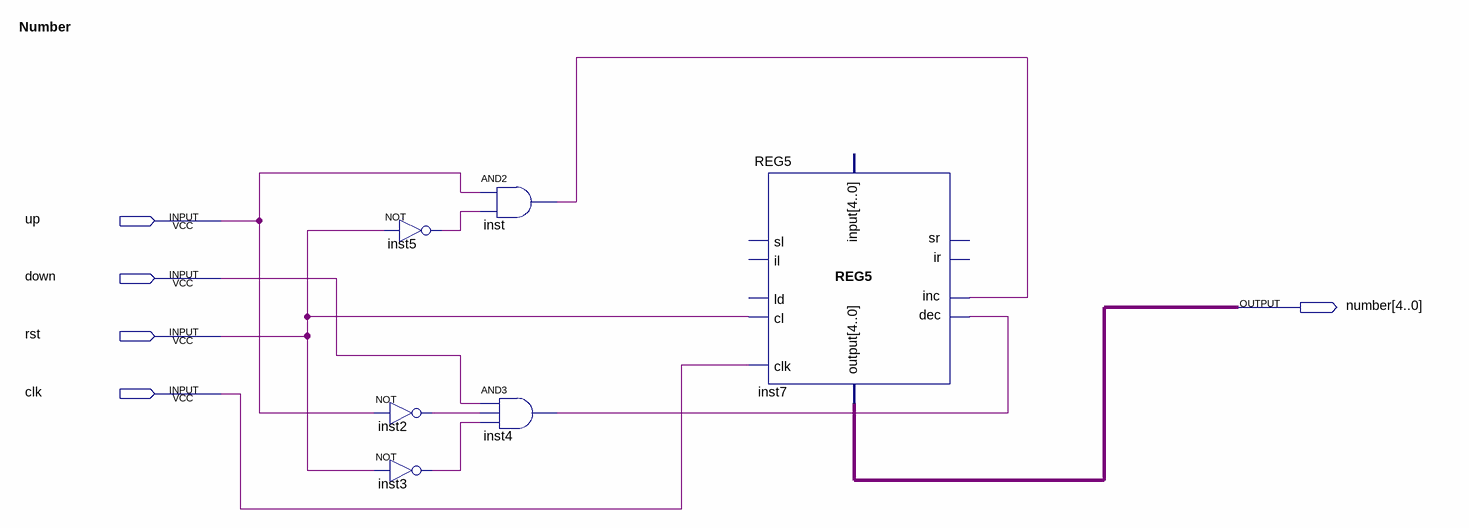
[diagram p0: schematic sheet]
// Quartus schematic Number.bdf as structural Verilog: 6 symbols, 5 pins
module Number (
  input  up,
  input  down,
  input  rst,
  input  clk,
  output [4:0] number
);

  wire inst2_out, inst3_out, inst4_out, inst5_out, inst_out;

  not inst5 (inst5_out, rst);
  not inst2 (inst2_out, up);
  not inst3 (inst3_out, rst);
  and inst (inst_out, up, inst5_out);
  and inst4 (inst4_out, down, inst2_out, inst3_out);
  REG5 inst7 (
    .clk(clk), .inc(inst_out), .dec(inst4_out), .cl(rst), .\output (number));  // open: ld, input, sr, ir, sl, il

  // Notes on the sheet:
  //   Number
endmodule
